# EAGLE design DroidCONuino v1.2 (EAGLE 6.4)
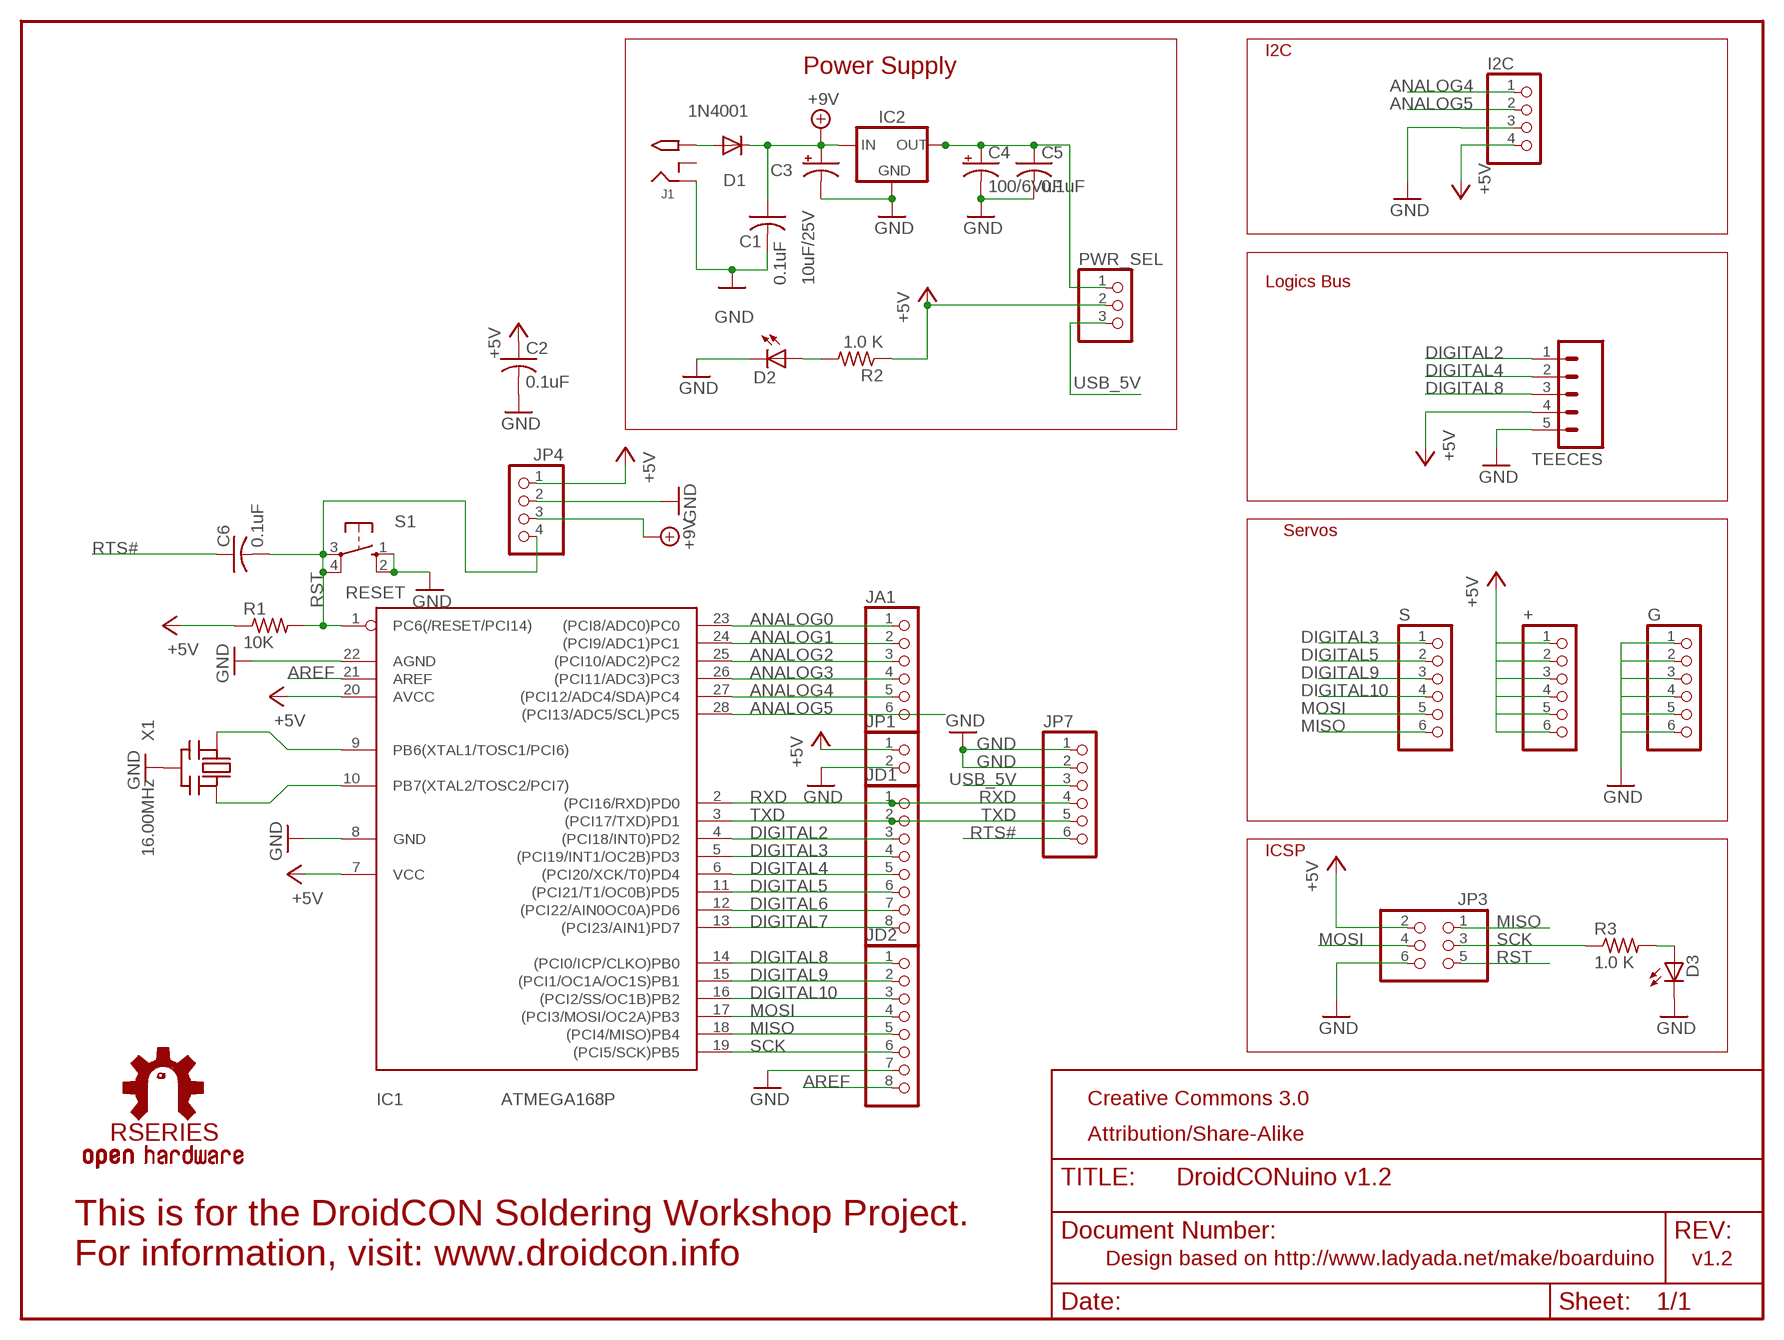
[diagram p0: schematic, sheet 1]

## Parts
+  PINHD-1X6CLEAN  [1X06-CLEAN]
C1  0.1uF  C-US025-025X050  [C025-025X050]
C2  0.1uF  C-US025-025X050  [C025-025X050]
C3  10uF/25V  CPOL-USE2.5-6  [E2,5-6]
C4  100/6VuF  CPOL-USE2.5-6  [E2,5-6]
C5  0.1uF  C-US025-025X050  [C025-025X050]
C6  0.1uF  C-US025-025X050  [C025-025X050]
D1  1N4001  1N4004  [DO41-10]
D2  LED3MM  [LED3MM]
D3  Green  LED3MM  [LED3MM]
G  PINHD-1X6CLEAN  [1X06-CLEAN]
I2C  PINHD-1X4CB  [1X04-CB]
IC1  ATMEGA168P  ATMEGA168PROUND  [DIL28/3]
IC2  78XXS  [78XXS]
J1  2.1MMJACK  [PJ-102A]
JA1  PINHD-1X6CB  [1X06-CLEANBIG]
JD1  PINHD-1X8CLEANBIG  [1X08-CLEANBIG]
JD2  PINHD-1X8CLEANBIG  [1X08-CLEANBIG]
JP1  PINHD-1X2CB  [1X02-CB]
JP3  PINHD-2X3  [2X03]
JP4  PINHD-1X4CB  [1X04-CB]
JP7  PINHD-1X6CLEAN  [1X06-CLEAN]
PWR_SEL  PINHD-1X3  [1X03]
R1  10K  R-US_0207/5V  [0207/5V]
R2  1.0 K  R-US_0207/5V  [0207/5V]
R3  1.0 K  R-US_0207/5V  [0207/5V]
S  PINHD-1X6CLEAN  [1X06-CLEAN]
S1  RESET  10-XX  [B3F-10XX]
TEECES  M05PTH  [1X05]
U$2  RSERIES-OSHW-LOGOMEDIUM  [RSERIES-OSHW-LOGO-MEDIUM]
X1  16.00MHz  CERMOSCILL  [CERM_OSC]

## Nets
+5V [supply]: +.1 +.2 +.3 +.4 +.5 +.6 C2.1 I2C.4 IC1.7(VCC) IC1.20(AVCC) JP1.1 JP3.2 JP4.1 PWR_SEL.2 R1.1 R2.1 TEECES.4
+9V [supply]: C1.1 C3.+ D1.C IC2.IN JP4.3
ANALOG0: IC1.23((PCI8/ADC0)PC0) JA1.1
ANALOG1: IC1.24((PCI9/ADC1)PC1) JA1.2
ANALOG2: IC1.25((PCI10/ADC2)PC2) JA1.3
ANALOG3: IC1.26((PCI11/ADC3)PC3) JA1.4
ANALOG4: I2C.1 IC1.27((PCI12/ADC4/SDA)PC4) JA1.5
ANALOG5: I2C.2 IC1.28((PCI13/ADC5/SCL)PC5) JA1.6
AREF: IC1.21(AREF) JD2.8
DIGITAL2: IC1.4((PCI18/INT0)PD2) JD1.3 TEECES.1
DIGITAL3: IC1.5((PCI19/INT1/OC2B)PD3) JD1.4 S.1
DIGITAL4: IC1.6((PCI20/XCK/T0)PD4) JD1.5 TEECES.2
DIGITAL5: IC1.11((PCI21/T1/OC0B)PD5) JD1.6 S.2
DIGITAL6: IC1.12((PCI22/AIN0OC0A)PD6) JD1.7
DIGITAL7: IC1.13((PCI23/AIN1)PD7) JD1.8
DIGITAL8: IC1.14((PCI0/ICP/CLKO)PB0) JD2.1 TEECES.3
DIGITAL9: IC1.15((PCI1/OC1A/OC1S)PB1) JD2.2 S.3
DIGITAL10: IC1.16((PCI2/SS/OC1B)PB2) JD2.3 S.4
GND [supply]: C1.2 C2.2 C3.- C4.- C5.2 D2.K(C) D3.K(C) G.1 G.2 G.3 G.4 G.5 G.6 I2C.3 IC1.8(GND) IC1.22(AGND) IC2.GND J1.RING JD2.7 JP1.2 JP3.6 JP4.2 JP7.1 JP7.2 S1.1(S) S1.2(S1) TEECES.5 X1.P$2(GND)
MISO: IC1.18((PCI4/MISO)PB4) JD2.5 JP3.1 S.6
MOSI: IC1.17((PCI3/MOSI/OC2A)PB3) JD2.4 JP3.4 S.5
N$1: IC1.9(PB6(XTAL1/TOSC1/PCI6)) X1.P$1(IN)
N$2: IC1.10(PB7(XTAL2/TOSC2/PCI7)) X1.P$3(OUT)
N$3 [supply]: D2.A R2.2
N$4: D3.A R3.2
N$17: D1.A J1.TIP
N$22 [supply]: C4.+ C5.1 IC2.OUT PWR_SEL.1
RST: C6.2 IC1.1(PC6(/RESET/PCI14)) JP3.5 JP4.4 R1.2 S1.3(P) S1.4(P1)
RTS#: C6.1 JP7.6
RXD: IC1.2((PCI16/RXD)PD0) JD1.1 JP7.4
SCK: IC1.19((PCI5/SCK)PB5) JD2.6 JP3.3 R3.1
TXD: IC1.3((PCI17/TXD)PD1) JD1.2 JP7.5
USB_5V: JP7.3 PWR_SEL.3
Unconnected: J1.RING_SW

## Notes on the sheet
- I2C
- Power Supply
- Logics Bus
- Servos
- ICSP
- Creative Commons 3.0
- Attribution/Share-Alike
- This is for the DroidCON Soldering Workshop Project.
  For information, visit: www.droidcon.info
- Design based on http://www.ladyada.net/make/boarduino | v1.2

## Library data of the parts
+ G JA1 JP7 S = carduino:PINHD-1X6: PIN HEADER
C1 C2 C5 C6 = minimidi:C-US: CAPACITOR, American symbol
C3 C4 = minimidi:CPOL-US: POLARIZED CAPACITOR, American symbol
D1 = minimidi:1N4004: DIODE general purpose rectifier, 1 A
D2 D3 = minimidi:LED: LED OSRAM: - CHIPLED LG R971, LG N971, LY N971, LG Q971, LY Q971, LO R971, LY R971 LH N974, LH R974 LS Q976, LO Q976, LY Q976 LO Q996 - Hyper CHIPLED LW Q18S LB Q993, LB Q99A, LB R99A - SideLED LS A670, LO A670, LY A670, LG A670, LP A670 LB A673, LV A673, LT A673, LW A673 LH A674 LY A675 LS A676, LA A676, LO A676, LY A676, LW A676 LS A679, LY A679, LG A679 - Hyper Micro SIDELED® LS Y876, LA Y876, LO Y876, LY Y876 LT Y87S - SmartLED LW L88C, LW L88S LB L89C, LB L89S, LG L890 LS L89K, LO L89K, LY L89K LS L896, LA L896, LO L896, LY L896 - TOPLED LS T670, LO T670, LY T670, LG T670, LP T670 LSG T670, LSP T670, LSY T670, LOP T670, LYG T670 LG T671, LOG T671, LSG T671 LB T673, LV T673, LT T673, LW T673 LH T674 LS T676, LA T676, LO T676, LY T676, LB T676, LH T676, LSB T676, LW T676 LB T67C, LV T67C, LT T67C, LS T67K, LO T67K, LY T67K, LW E67C LS E67B, LA E67B, LO E67B, LY E67B, LB E67C, LV E67C, LT E67C LW T67C LS T679, LY T679, LG T679 LS T770, LO T770, LY T770, LG T770, LP T770 LB T773, LV T773, LT T773, LW T773 LH T774 LS E675, LA E675, LY E675, LS T675 LS T776, LA T776, LO T776, LY T776, LB T776 LHGB T686 LT T68C, LB T68C - Hyper Mini TOPLED® LB M676 - Mini TOPLED Santana® LG M470 LS M47K, LO M47K, LY M47K Source: http://www.osram.convergy.de/
I2C JP4 = carduino:PINHD-1X4: PIN HEADER
IC1 = avr:ATMEGA168*P: MICROCONTROLLER 16 kBytes FLASH 1 kBytes SRAM 512 Bytes EEPROM USART 8-channel 10 bit ADC
IC2 = v-reg:78XXS: VOLTAGE REGULATOR
J1 = minimidi:2.1MMJACK
JD1 JD2 = carduino:PINHD-1X8: PIN HEADER
JP1 = carduino:PINHD-1X2: PIN HEADER
JP3 = pinhead-ez:PINHD-2X3: PIN HEADER
PWR_SEL = pinhead:PINHD-1X3: PIN HEADER
R1 = rcl-ez:R-US_: RESISTOR, American symbol
R2 R3 = minimidi:R-US_: RESISTOR, American symbol
S1 = switch-omron:10-XX: OMRON SWITCH
TEECES = SparkFun-Connectors:M05: Header 5 Standard 5-pin 0.1" header. Use with straight break away headers (SKU : PRT-00116), right angle break away headers (PRT-00553), swiss pins (PRT-00743), machine pins (PRT-00117), and female headers (PRT-00115). Molex polarized connector foot print use with SKU : PRT-08230 with associated crimp pins and housings.
U$2 = rseries:RSERIES-OSHW-LOGO
X1 = digg:CERMOSCILL

## Net classes
1 supply: width 0.381 mm, drill 0.152 mm, clearance 0.152 mm

## Board
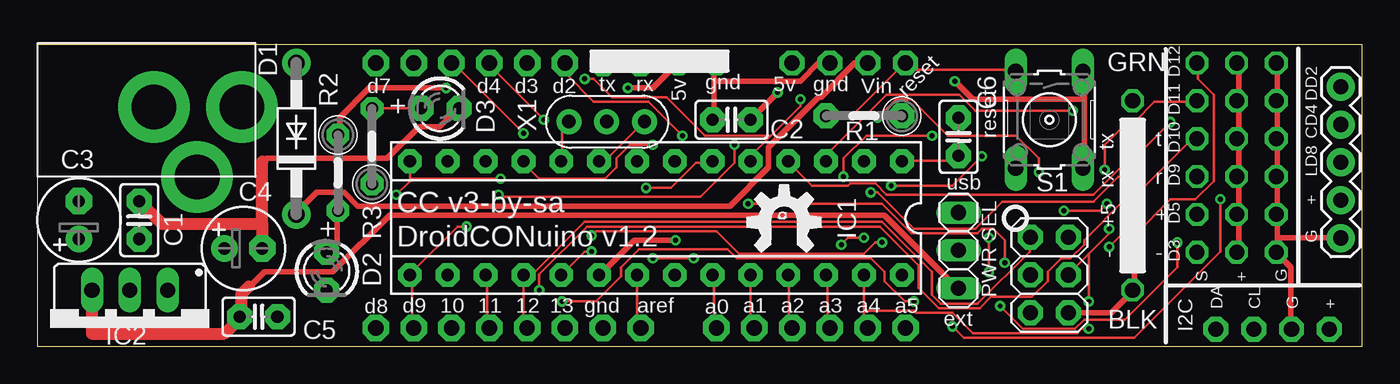
[diagram p1: board, top side]
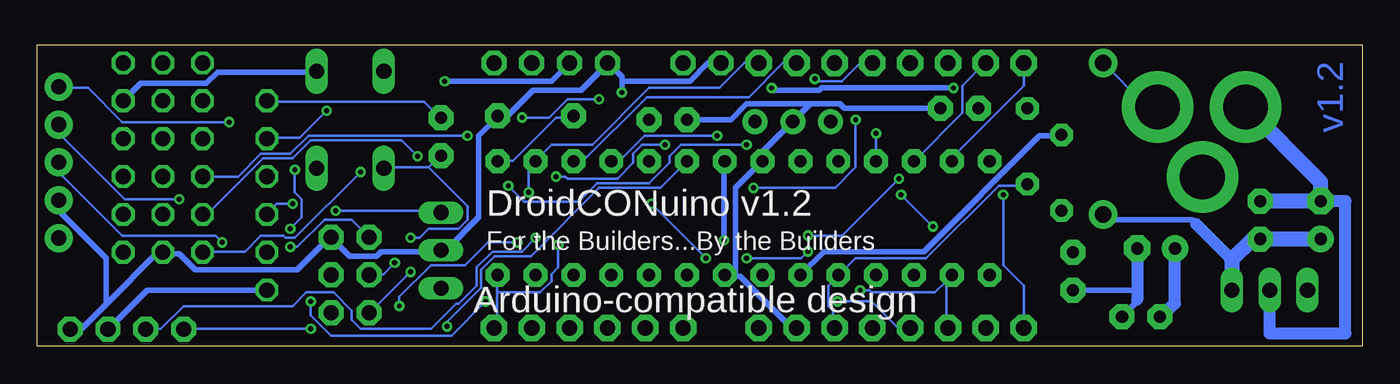
[diagram p2: board, bottom side, seen from below]

Size 88.94 x 20.24 mm. Coordinates in mm from the lower left corner, seen from the top.
Outline: 0,0 88.94,0 88.94,20.24 0,20.24 0,0
Copper layers (1*16): Top 0.0356mm / dielectric 1.5011mm / Bottom 0.0356mm
Design rules "LaenPCBOrder *": minimum track width 6mil, minimum drill 13mil, track to track 6mil, track to pad 6mil, pad to pad 6mil, via to via 12mil, smd to smd 6mil, copper to edge 15mil, drill to drill 6mil, minimum pad ring 7mil, minimum via ring 7mil, stop-mask expansion 4mil, vias tented up to drill 0mil, thermal gap 10mil

### Footprints (pad centres in the part's own frame; a part is rotated, then mirrored left to right if it is on the bottom)
1X06-CLEAN = drill 1.016 octagon: 1 -6.35,0; 2 -3.81,0; 3 -1.27,0; 4 1.27,0; 5 3.81,0; 6 6.35,0
C025-025X050 = drill 0.813 pad 1.676 octagon: 1 -1.27,0; 2 1.27,0
E2,5-6 = drill 0.813 pad 1.778: + -1.27,0 | drill 0.813 pad 1.778 octagon: - 1.27,0
DO41-10 = drill 1.118 pad 1.93: A 5.08,0; C -5.08,0
LED3MM = drill 0.813 pad 1.676 octagon: A -1.27,0; K 1.27,0
1X04-CB = drill 1.016 pad 1.676 octagon: 1 -3.81,0; 2 -1.27,0; 3 1.27,0; 4 3.81,0
DIL28/3 = drill 0.813 pad 1.6 octagon: 1 -16.51,-3.81; 2 -13.97,-3.81; 3 -11.43,-3.81; 4 -8.89,-3.81; 5 -6.35,-3.81; 6 -3.81,-3.81; 7 -1.27,-3.81; 8 1.27,-3.81; 9 3.81,-3.81; 10 6.35,-3.81; 11 8.89,-3.81; 12 11.43,-3.81; 13 13.97,-3.81; 14 16.51,-3.81; 15 16.51,3.81; 16 13.97,3.81; 17 11.43,3.81; 18 8.89,3.81; 19 6.35,3.81; 20 3.81,3.81; 21 1.27,3.81; 22 -1.27,3.81; 23 -3.81,3.81; 24 -6.35,3.81; 25 -8.89,3.81; 26 -11.43,3.81; 27 -13.97,3.81; 28 -16.51,3.81
78XXS = drill 1.016 long: GND 0,-2.54; IN -2.54,-2.54; OUT 2.54,-2.54
PJ-102A = drill 3 pad 4.8: RING 0.1,-3.39; RING_SW -4.6,-6.29; TIP 0.1,-9.29
1X06-CLEANBIG = drill 1.016 pad 1.778 octagon: 1 -6.35,0; 2 -3.81,0; 3 -1.27,0; 4 1.27,0; 5 3.81,0; 6 6.35,0
1X08-CLEANBIG = drill 1.016 pad 1.778 octagon: 1 -8.89,0; 2 -6.35,0; 3 -3.81,0; 4 -1.27,0; 5 1.27,0; 6 3.81,0; 7 6.35,0; 8 8.89,0
1X02-CB = drill 1.016 pad 1.676 octagon: 1 -1.27,0; 2 1.27,0
2X03 = drill 1.016 pad 1.676 octagon: 1 -2.54,-1.27; 2 -2.54,1.27; 3 0,-1.27; 4 0,1.27; 5 2.54,-1.27; 6 2.54,1.27
1X03 = drill 1.016 long: 1 -2.54,0; 2 0,0; 3 2.54,0
0207/5V = drill 0.813 pad 1.676 octagon: 1 -2.54,0; 2 2.54,0
0207/5V' = drill 0.813 pad 1.524 octagon: 1 -2.54,0; 2 2.54,0
B3F-10XX = drill 1.016 long: 1 -3.251,2.261; 2 3.251,2.261; 3 -3.251,-2.261; 4 3.251,-2.261
1X05 = drill 1.016 pad 1.88: 1 0,0; 2 2.54,0; 3 5.08,0; 4 7.62,0; 5 10.16,0
CERM_OSC = drill 0.9 pad 1.676: P$1 -2.54,0; P$2 0,0; P$3 2.54,0

### Placement (x,y rotation side)
+  80.51,12.66 90 top
C1  6.85,8.47 90 top
C2  46.6,15.2 180 top
C3  2.79,8.47 90 top
C4  13.84,6.57 0 top
C5  14.85,1.99 0 top
C6  61.84,14.06 270 top
D1  17.39,13.93 90 top
D2  19.43,5.04 270 top
D3  27.05,15.96 0 top
G  83.18,12.66 90 top
I2C  82.93,1.16 0 top
IC1  41.52,8.6 180 top
IC2  6.22,1.23 180 top
J1  4.44,15.96 90 top
JA1  51.94,1.23 0 top
JD1  31.62,19.01 180 top
JD2  31.62,1.23 0 top
JP1  44.32,19.01 0 top
JP3  67.94,4.79 270 top
JP4  54.48,19.01 0 top
JP7  73.53,10.12 90 top
PWR_SEL  61.84,6.44 90 top
R1  55.49,15.46 180 top
R2  1.0 K  [0207/5V']  20.19,11.65 270 top
R3  1.0 K  [0207/5V']  22.47,13.42 90 top
S  77.85,12.66 90 top
S1  67.94,15.2 270 top
TEECES  87.5,17.42 270 top
U$2  50.03,8.38 0 top
X1  38.22,15.07 180 top

### Tracks (layer width: path | path; a pad name or v marks a point on that pad's centre or on a via)
+5V  (via drill 0.33)
  Top 0.381: v42.84,7.12 40.1,7.12 37.82,4.84 IC1.20 | +.6 80.64,19.01 80.64,16.57 +.5 80.64,16.42 80.64,13.98 +.4 80.64,13.83 80.64,11.39 +.3 80.64,11.24 80.64,8.95 +.2 80.64,8.8 80.64,6.36 +.1 | v49.7,17.03 C2.1 | v27.45,17.34 22.27,17.34 20.29,15.35 20.29,14.29 R2.1 | v39.64,17.34 41.32,17.34 43,19.01 JP1.1
  Bottom 0.381: R2.1 20.29,14.13 21.66,14.13 29.43,6.36 36.14,6.36 37.66,4.84 IC1.20 | v42.84,7.12 42.84,12.31 IC1.7 | 84.22,2.93 80.94,6.21 80.64,6.21 +.1 80.33,6.21 79.42,6.21 78.35,5.14 71.5,5.14 69.36,7.28 JP3.2 69.21,7.28 67.99,6.06 66.16,6.06 65.86,6.36 61.9,6.36 PWR_SEL.2 61.74,6.51 61.44,6.51 59.3,8.65 59.3,14.13 58.09,15.35 R1.1 57.93,15.51 57.32,15.51 55.65,17.18 52.45,17.18 50.77,18.86 JP4.1 50.62,19.01 49.7,18.1 49.7,17.79 | 84.22,2.93 85.97,1.18 86.74,1.18 I2C.4 | TEECES.4 87.5,9.72 87.5,9.11 84.3,5.91 84.3,3.01 84.22,2.93 | 49.7,17.79 v49.7,17.03 | JP1.1 43.15,19.01 43.91,19.01 45.13,17.79 49.55,17.79 49.7,17.79 | v27.45,17.34 36.29,17.34 36.44,17.18 39.49,17.18 v39.64,17.34
+9V
  Top 0.381: JP4.3 55.65,19.01 54.88,19.01 52.6,16.73 52.45,16.73 49.09,13.37 49.09,12 46.5,9.41 21.51,9.41 20.59,10.32 18.77,10.32 17.39,8.95 D1.C
  Bottom 0.381: 11.17,8.22 11.45,8.5 17.09,8.5 17.39,8.8 D1.C
  Bottom 0.508: C1.1 7.36,7.2
  Bottom 0.813: 8.76,5.8 11.17,8.22
  Bottom 1.016: C3.+ C1.1 | IC2.IN 8.76,5.8 7.36,7.2
ANALOG0
  Top 0.152: IC1.23 45.44,4.69 45.44,1.49 45.59,1.33 JA1.1
ANALOG1
  Top 0.152: IC1.24 47.87,4.69 47.87,1.49 48.03,1.33 JA1.2
ANALOG2
  Top 0.152: IC1.25 50.47,4.69 50.47,1.49 50.62,1.33 JA1.3
ANALOG3
  Top 0.152: IC1.26 53.06,4.69 53.06,1.49 53.21,1.33 JA1.4
ANALOG4  (via drill 0.33)
  Top 0.152: 55.49,2.4 55.49,1.49 55.65,1.33 JA1.5 | 55.49,2.4 55.49,4.69 IC1.27 | v70.58,1.18 70.12,1.18 69.82,0.88 62.81,0.88 61.44,2.25 59,2.25 58.85,2.4 55.49,2.4
  Bottom 0.152: v70.58,1.18 79.12,1.18 I2C.1
ANALOG5  (via drill 0.33)
  Top 0.152: v55.49,7.28 54.43,7.28 v53.97,6.82
  Bottom 0.152: 58.09,3.62 58.09,1.49 58.24,1.33 JA1.6 | 58.09,3.62 58.09,4.69 IC1.28 | v55.49,7.28 56.41,6.36 58.39,6.36 59.46,5.3 59.46,4.08 60.68,2.86 60.83,2.86 62.5,1.18 67.23,1.18 67.84,1.79 67.84,2.4 69.06,3.62 70.89,3.62 71.8,2.71 79.12,2.71 80.64,1.18 81.55,1.18 I2C.2 | v53.97,6.82 53.97,5.3 54.43,4.84 54.43,4.38 55.19,3.62 58.09,3.62
AREF
  Top 0.152: IC1.21 40.25,4.69 40.25,1.49 40.41,1.33 JD2.8
DIGITAL2  (via drill 0.33)
  Top 0.152: v43.3,14.13 41.02,16.42 37.36,16.42 35.53,18.25 35.53,19.01 JD1.3 | v76.07,15.05 73.48,12.46 73.17,12.46 70.89,10.17 57.02,10.17 56.26,10.94 54.58,10.94 54.43,10.78 51.99,10.78 50.47,12.31 IC1.4
  Bottom 0.152: v43.3,14.13 48.18,14.13 49.86,12.46 50.31,12.46 IC1.4 | v76.07,15.05 83.23,15.05 85.52,17.34 87.5,17.34 TEECES.1
DIGITAL3  (via drill 0.33)
  Top 0.152: v67.23,11.7 67.23,12.61 65.7,14.13 61.13,14.13 58.69,16.57 57.63,16.57 v56.41,15.35 | v51.23,16.57 51.23,16.12 49.25,14.13 | 49.25,14.13 47.87,12.76 47.87,12.46 IC1.5 | v36.75,17.95 37.36,17.95 38.58,16.73 42.23,16.73 44.83,14.13 49.25,14.13
  Bottom 0.152: v67.23,11.7 71.65,7.28 72.26,7.28 72.41,7.43 73.93,7.43 75,6.36 77.74,6.36 S.1 | v56.41,15.35 54.58,15.35 53.36,16.57 v51.23,16.57 | v36.75,17.95 36.6,17.79 34.92,17.79 33.7,19.01 32.94,19.01 JD1.4
DIGITAL4  (via drill 0.33)
  Top 0.152: v40.86,10.63 42.54,10.63 44.22,12.31 45.28,12.31 IC1.6 | v34.01,15.2 30.35,18.86 JD1.5 | v79.42,9.87 79.42,6.36 73.63,0.57 62.2,0.57 v61.44,1.33
  Bottom 0.152: v40.86,10.63 35.38,10.63 34.01,12 v34.01,15.2 | v79.42,9.87 83.08,9.87 87.5,14.29 87.5,14.74 TEECES.2 | v61.44,1.33 61.44,1.64 59.15,3.92 59.15,5.14 58.24,6.06 55.8,6.06 51.23,10.63 47.11,10.63 45.44,12.31 IC1.6
DIGITAL5  (via drill 0.33)
  Top 0.152: v63.42,12.76 61.44,10.78 v57.32,10.78 | v41.32,13.53 39.8,13.53 38.88,12.61 38.88,12 38.12,11.24 33.7,11.24 32.63,12.31 IC1.11 | v32.63,14.29 27.91,19.01 JD1.6
  Bottom 0.152: v63.42,12.76 64.49,13.83 70.58,13.83 71.8,12.61 73.78,12.61 77.44,8.95 77.74,8.95 S.2 | v57.32,10.78 56.26,9.72 52.6,9.72 51.38,10.94 47.87,10.94 46.5,12.31 46.5,12.76 45.74,13.53 v41.32,13.53 | v32.63,14.29 32.63,12.46 IC1.11
DIGITAL6
  Bottom 0.152: IC1.12 30.04,12.46 26.84,15.66 26.84,17.49 25.32,19.01 JD1.7
DIGITAL7
  Bottom 0.152: JD1.8 22.73,17.49 27.45,12.76 27.45,12.46 IC1.13
DIGITAL8  (via drill 0.33)
  Top 0.152: 25.01,11.24 25.01,11.09 v24.1,10.17 | 25.01,11.24 25.01,12.31 IC1.14 | v76.52,6.97 76.52,5.3 73.02,1.79 70.28,1.79 69.67,1.18 66.16,1.18 v64.64,2.71 | v56.71,6.97 56.26,6.97 55.49,6.21 47.11,6.21 45.59,7.73 37.51,7.73 v37.21,7.43 | 25.01,11.24 v31.11,11.24
  Bottom 0.152: v24.1,10.17 24.1,5.45 22.73,4.08 22.73,1.33 JD2.1 | v76.52,6.97 76.98,7.43 83.23,7.43 87.5,11.7 87.5,12.31 TEECES.3 | v64.64,2.71 64.64,3.32 62.5,5.45 60.22,5.45 58.69,6.97 v56.71,6.97 | v37.21,7.43 34.92,7.43 v31.11,11.24
DIGITAL9  (via drill 0.33)
  Top 0.152: v60.07,14.13 55.65,14.13 54.12,12.61 v54.12,11.39 | v46.81,13.53 46.81,12.31 44.52,10.02 31.11,10.02 v30.96,10.17 | v28.82,8.04 28.21,8.04 25.17,4.99 | 25.17,4.99 25.01,4.84 IC1.15 25.17,4.99 | 25.17,4.99 25.17,1.33 JD2.2
  Bottom 0.152: v60.07,14.13 70.73,14.13 71.95,12.92 73.93,12.92 75.46,11.39 77.74,11.39 S.3 | v54.12,11.39 53.51,11.39 53.36,11.24 50.01,11.24 48.94,12.31 48.94,12.92 48.33,13.53 v46.81,13.53 | v28.82,8.04 v30.96,10.17
DIGITAL10  (via drill 0.33)
  Top 0.152: v33.7,3.77 33.7,4.84 36.9,8.04 56.56,8.04 59.15,5.45 59.15,3.92 60.52,2.55 63.27,2.55 64.03,3.32 66.77,3.32 67.84,4.38 67.84,4.99 68.75,5.91 69.36,5.91 70.28,6.82 70.28,7.12 73.02,9.87 73.48,9.87 77.44,13.83 77.74,13.83 S.4
  Bottom 0.152: v33.7,3.77 33.09,3.77 32.94,3.62 28.67,3.62 27.91,4.38 | 27.91,4.38 27.6,4.69 IC1.16 27.91,4.38 | 27.91,4.38 27.91,1.33 JD2.3
GND  (via drill 0.33)
  Top 0.152: 15.41,12.61 15.11,12.41 15.41,12.61
  Top 0.305: 15.41,12.61 15.11,12.41
  Top 0.381: JP7.2 73.63,6.21 73.63,3.77 JP7.1 73.48,3.62 72.11,2.25 JP3.6 | 70.28,16.57 70.28,18.4 S1.1 | 70.28,16.57 70.28,12 S1.2 | G.6 83.23,19.01 83.23,16.57 G.5 83.23,16.42 83.23,13.98 G.4 83.23,13.83 83.23,11.39 G.3 83.23,11.24 83.23,8.95 G.2 83.23,8.8 83.23,7.28 | 83.23,7.28 83.23,6.36 G.1 83.23,6.21 84.14,5.3 84.14,1.18 I2C.3 | TEECES.5 87.5,7.28 83.38,7.28 83.23,7.28 | 45.44,17.79 45.44,18.86 JP1.2 | 45.44,17.79 45.44,15.2 C2.2 | JP4.2 52.45,19.01 51.23,17.79 45.59,17.79 45.44,17.79 | 15.41,12.61 15.56,12.61 23.49,12.61 25.62,14.74 26.99,14.74 28.21,15.96 D3.K | v61.59,17.79 62.81,16.57 70.12,16.57 70.28,16.57
  Top 0.813: 15.11,8.22 C4.- | 15.11,8.22 15.11,12.41 | 15.11,8.22 8.38,8.22 C1.2
  Bottom 0.305: 15.41,3.77 15.11,3.77
  Bottom 0.381: S1.1 70.28,18.4 76.83,18.4 77.59,17.64 82.01,17.64 83.08,16.57 G.5 | JP7.1 73.63,3.77 81.55,3.77 84.14,1.18 I2C.3 | JD2.7 37.97,1.33 38.43,1.33 41.78,4.69 42.69,4.69 IC1.22 42.08,4.84 42.08,10.63 40.41,12.31 IC1.8 40.25,12.46 40.25,13.07 38.27,15.05 X1.P$2 38.12,15.2 37.05,16.27 | C5.2 16.02,2.1 15.26,2.86 15.11,3.14 | 15.11,3.77 15.41,3.77 19.38,3.77 D2.K | 37.05,16.27 35.07,16.27 34.77,15.96 28.37,15.96 D3.K | C2.2 45.28,15.2 42.39,15.2 41.32,16.27 37.21,16.27 37.05,16.27 | v61.59,17.79 54.43,17.79 JP4.2
  Bottom 0.813: C3.- 1.14,9.74 1.14,0.85 6.22,0.85 IC2.GND | C4.- 15.11,3.77 15.11,3.14
  Bottom 1.016: J1.RING 2.79,11.02 C3.- C1.2
MISO  (via drill 0.33)
  Top 0.152: JD2.5 32.79,1.33 32.63,1.49 32.63,4.69 IC1.18 32.63,4.84 33.24,4.84 36.75,8.34 56.71,8.34 60.07,4.99 60.07,3.47 60.68,2.86 63.11,2.86 66.62,6.36 66.62,7.28 JP3.1 | v71.95,6.67 72.71,7.43 73.63,7.43 76.07,9.87 77.74,9.87 78.96,11.09 78.96,16.88 77.9,17.95 77.9,19.01 S.6
  Bottom 0.152: v71.95,6.67 71.5,6.67 69.67,8.5 67.84,8.5 66.77,7.43 JP3.1
MOSI  (via drill 0.33)
  Top 0.152: IC1.17 30.2,4.69 30.2,1.49 30.35,1.33 JD2.4 | v71.65,11.85 71.65,13.53 73.17,15.05 73.63,15.05 75,16.42 77.74,16.42 S.5 | v71.95,7.89 71.95,7.58 70.58,6.21 | 70.58,6.21 69.21,4.84 JP3.4 | v35.23,3.01 37.51,3.01 39.19,4.69 39.19,5.3 40.41,6.51 46.35,6.51 46.96,5.91 55.95,5.91 56.87,4.99 56.87,4.38 58.24,3.01 v58.85,3.01 | 70.58,6.21 v70.58,3.01
  Bottom 0.152: v71.65,11.85 71.65,10.32 71.19,9.87 71.19,8.65 v71.95,7.89 | v35.23,3.01 32.94,3.01 31.26,1.33 30.35,1.33 JD2.4 | v58.85,3.01 61.13,0.72 69.21,0.72 70.58,2.1 v70.58,3.01
N$1
  Top 0.152: IC1.9 37.82,12.46 38.12,12.46 40.71,15.05 X1.P$1
N$2
  Top 0.152: IC1.10 35.23,12.46 35.23,14.59 35.68,15.05 X1.P$3
N$3
  Top 0.381: R2.2 20.14,9.11 20.14,6.97 19.53,6.36 D2.A
N$4
  Top 0.152: D3.A 22.58,15.96 R3.2
N$17
  Bottom 0.152: 14.65,16.27 J1.TIP 14.65,16.27 | 14.65,16.27 D1.A
  Bottom 0.61: J1.TIP 13.63,15.96
  Bottom 1.016: 13.33,15.96 13.63,15.96 14.35,15.96
N$22
  Top 0.381: PWR_SEL.1 61.74,3.92 56.87,8.8 23.64,8.8 19.83,4.99 15.26,4.99 14.5,4.23 14.22,4.03
  Top 0.508: 13.71,2.12 C5.1 13.58,1.87
  Top 0.813: 14.22,4.03 13.71,3.52 13.71,2.12 | IC2.OUT 3.68,0.85 12.57,0.85 13.58,1.87
  Bottom 0.508: C5.1 13.46,1.99
  Bottom 0.813: C4.+ 12.57,2.88 13.46,1.99
RST  (via drill 0.33)
  Top 0.152: S1.3 65.55,18.55 58.85,18.55 58.39,19.01 JP4.4 58.24,19.01 54.73,15.51 53.06,15.51 R1.2 | IC1.1 58.09,12.46 61.44,12.46 61.74,12.76 C6.2 | v63.88,7.28 v63.88,4.99
  Bottom 0.152: 62.66,12 65.55,12 S1.4 | 62.66,12 61.9,12.76 C6.2 | v63.88,4.99 66.62,2.25 JP3.5 | v63.88,7.28 63.27,7.28 62.66,7.89 60.68,7.89 60.07,8.5 60.07,9.41 62.66,12 | R1.2 53.06,15.35 54.12,15.35 57.02,12.46 57.93,12.46 IC1.1
RTS#
  Bottom 0.152: JP7.6 73.48,16.42 62.96,16.42 61.9,15.35 C6.1
RXD  (via drill 0.33)
  Top 0.152: v55.95,10.32 56.41,10.32 58.85,7.89 62.96,7.89 64.79,9.72 70.89,9.72 72.56,11.39 73.48,11.39 JP7.4
  Bottom 0.152: v55.95,10.32 55.95,11.85 55.49,12.31 IC1.2 55.49,12.46 54.43,13.53 51.68,13.53 47.87,17.34 43.15,17.34 41.47,19.01 40.56,19.01 JD1.1
SCK  (via drill 0.33)
  Top 0.152: v64.94,5.6 64.94,7.12 64.18,7.89 63.42,7.89 63.11,7.58 58.69,7.58 56.71,9.56 v47.72,9.56 | v41.32,5.91 v44.06,5.91 | v37.21,6.36 36.75,6.36 35.23,4.84 IC1.19
  Bottom 0.152: R3.1 22.58,10.78 24.4,10.78 29.28,5.91 34.01,5.91 35.07,4.84 IC1.19 35.23,4.69 35.83,4.08 35.83,2.71 35.53,2.4 35.53,1.33 JD2.6 | v64.94,5.6 65.7,4.84 66.62,4.84 JP3.3 | v44.06,5.91 v47.72,9.56 | v41.32,5.91 37.66,5.91 v37.21,6.36
TXD  (via drill 0.33)
  Top 0.152: v69.52,15.81 62.96,15.81 61.9,16.88 57.02,16.88 53.06,12.92 53.06,12.46 IC1.3
  Bottom 0.152: v69.52,15.81 71.34,13.98 73.48,13.98 JP7.5 | JD1.2 38.88,19.01 41.17,16.73 48.03,16.73 52.29,12.46 52.9,12.46 IC1.3
USB_5V  (via drill 0.33)
  Top 0.152: v68.91,9.11 71.34,9.11 v71.8,9.56
  Bottom 0.152: v68.91,9.11 61.9,9.11 PWR_SEL.3 | v71.8,9.56 72.87,9.56 73.48,8.95 JP7.3

### Text on the board
Bottom: v1.2
tPlace: D1 | d7 | d4 | d3 | d2 | tx | rx | 5v | gnd | Vin | C6 | GRN | gnd | 5v | reset | reset | R2 | + | C2 | D3 | X1 | R1 | C3 | tx | t | usb | C4 | rx | r | S1 | CC v3-by-sa | +5 | + | C1 | + | R3 | DroidCONuino v1.2 | IC1 | - | - | D2 | PWR SEL | C5 | d8 | d9 | 10 | 11 | 12 | 13 | gnd | aref | a0 | a1 | a2 | a3 | a4 | a5 | ext | BLK | IC2
bPlace: DroidCONuino v1.2 | For the Builders...By the Builders | Arduino-compatible design
_tsilk: D12 | DD2 | D11 | CD4 | D10 | D9 | LD8 | + | D5 | G | D3 | DA | CL | G | +